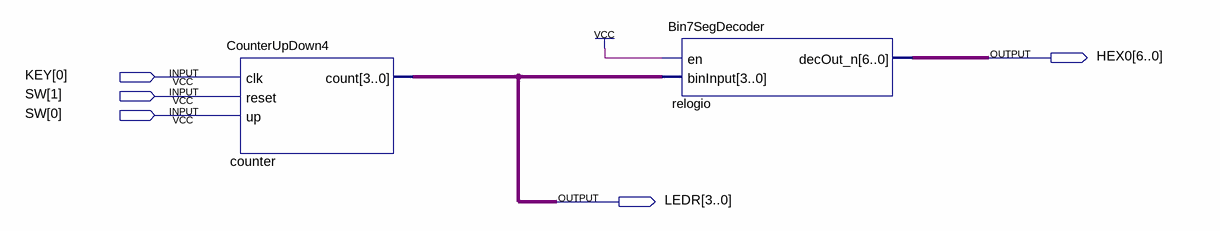
[diagram p0: schematic sheet]
// Quartus schematic Counter_Demo.bdf as structural Verilog: 2 symbols, 5 pins
module Counter_Demo (
  input  [0:0] KEY,
  input  [1:0] SW,
  output [6:0] HEX0,
  output [3:0] LEDR
);

  CounterUpDown4 counter (.clk(KEY[0]), .reset(SW[1]), .up(SW[0]), .count(LEDR));
  Bin7SegDecoder relogio (.en(1'b1), .binInput(LEDR), .decOut_n(HEX0));
endmodule
